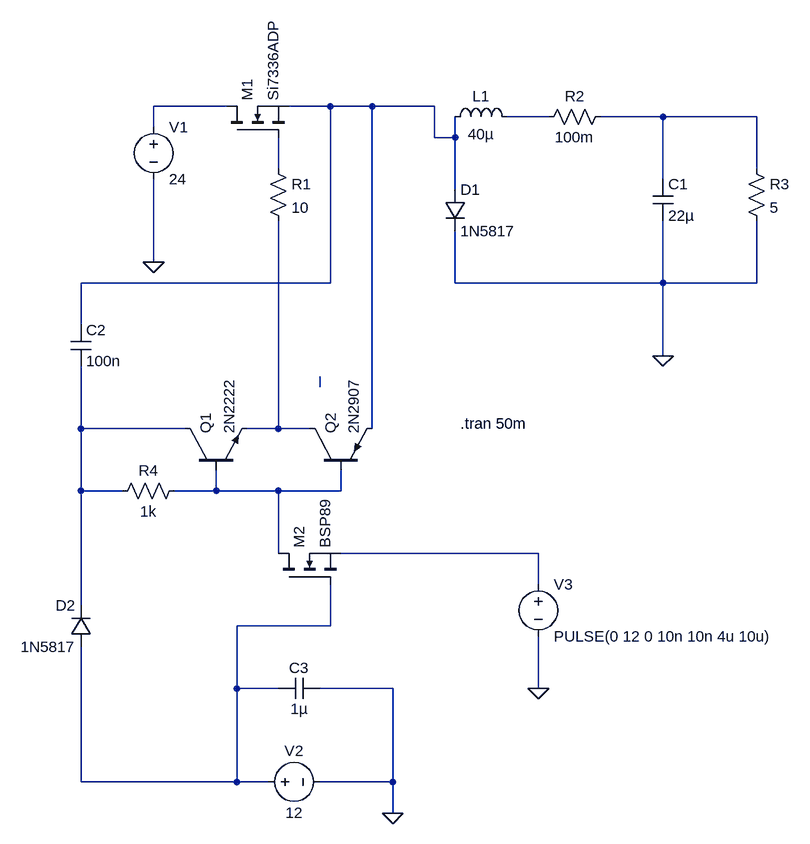
[diagram p0: schematic Draft1.asc]
Draft1.asc, the LTspice schematic file:
Version 4.1
SHEET 1 956 1172
WIRE 80 64 -32 64
WIRE 240 64 176 64
WIRE 304 64 240 64
WIRE 400 64 304 64
WIRE 576 80 512 80
WIRE 752 80 656 80
WIRE 896 80 752 80
WIRE -32 96 -32 64
WIRE 400 112 400 64
WIRE 432 112 432 80
WIRE 432 112 400 112
WIRE 160 160 160 112
WIRE 896 160 896 80
WIRE 752 176 752 80
WIRE 432 192 432 112
WIRE -32 304 -32 176
WIRE 240 336 240 64
WIRE 240 336 -144 336
WIRE 432 336 432 256
WIRE 752 336 752 240
WIRE 752 336 432 336
WIRE 896 336 896 240
WIRE 896 336 752 336
WIRE -144 400 -144 336
WIRE 752 448 752 336
WIRE 224 496 224 480
WIRE -144 560 -144 464
WIRE 16 560 -144 560
WIRE 160 560 160 240
WIRE 160 560 112 560
WIRE 208 560 160 560
WIRE 304 560 304 64
WIRE -144 656 -144 560
WIRE -80 656 -144 656
WIRE 64 656 64 624
WIRE 64 656 0 656
WIRE 160 656 64 656
WIRE 256 656 256 624
WIRE 256 656 160 656
WIRE 160 752 160 656
WIRE 560 752 256 752
WIRE 560 800 560 752
WIRE -144 832 -144 656
WIRE 240 864 240 800
WIRE 240 864 96 864
WIRE 96 960 96 864
WIRE 160 960 96 960
WIRE 336 960 224 960
WIRE 560 960 560 880
WIRE -144 1104 -144 896
WIRE 96 1104 96 960
WIRE 96 1104 -144 1104
WIRE 144 1104 96 1104
WIRE 336 1104 336 960
WIRE 336 1104 224 1104
WIRE 336 1152 336 1104
FLAG 752 448 0
FLAG -32 304 0
FLAG 336 1152 0
FLAG 560 960 0
SYMBOL voltage -32 80 R0
WINDOW 123 0 0 Left 0
WINDOW 39 0 0 Left 0
SYMATTR InstName V1
SYMATTR Value 24
SYMBOL ind 416 96 R270
WINDOW 0 32 56 VTop 2
WINDOW 3 5 56 VBottom 2
SYMATTR InstName L1
SYMATTR Value 40µ
SYMATTR SpiceLine Rser=1m
SYMBOL res 672 64 R90
WINDOW 0 0 56 VBottom 2
WINDOW 3 32 56 VTop 2
SYMATTR InstName R2
SYMATTR Value 100m
SYMBOL cap 736 176 R0
SYMATTR InstName C1
SYMATTR Value 22µ
SYMBOL res 880 144 R0
SYMATTR InstName R3
SYMATTR Value 5
SYMBOL diode 416 192 R0
SYMATTR InstName D1
SYMATTR Value 1N5817
SYMBOL nmos 80 112 R270
SYMATTR InstName M1
SYMATTR Value Si7336ADP
SYMBOL res 144 144 R0
SYMATTR InstName R1
SYMATTR Value 10
SYMBOL npn 16 624 R270
SYMATTR InstName Q1
SYMATTR Value 2N2222
SYMBOL pnp 208 624 R270
SYMATTR InstName Q2
SYMATTR Value 2N2907
SYMBOL cap -160 400 R0
SYMATTR InstName C2
SYMATTR Value 100n
SYMBOL voltage 128 1104 R270
WINDOW 0 32 56 VTop 2
WINDOW 3 -32 56 VBottom 2
WINDOW 123 0 0 Left 0
WINDOW 39 0 0 Left 0
SYMATTR InstName V2
SYMATTR Value 12
SYMBOL diode -128 896 R180
WINDOW 0 24 64 Left 2
WINDOW 3 24 0 Left 2
SYMATTR InstName D2
SYMATTR Value 1N5817
SYMATTR Description Diode
SYMATTR Type diode
SYMBOL cap 160 976 R270
WINDOW 0 32 32 VTop 2
WINDOW 3 0 32 VBottom 2
SYMATTR InstName C3
SYMATTR Value 1µ
SYMBOL nmos 160 800 R270
SYMATTR InstName M2
SYMATTR Value BSP89
SYMBOL voltage 560 784 R0
WINDOW 123 0 0 Left 0
WINDOW 39 0 0 Left 0
SYMATTR InstName V3
SYMATTR Value PULSE(0 12 0 10n 10n 4u 10u)
SYMBOL res 16 640 R90
WINDOW 0 0 56 VBottom 2
WINDOW 3 32 56 VTop 2
SYMATTR InstName R4
SYMATTR Value 1k
TEXT 440 552 Left 2 !.tran 50m

The netlist it stands for:
* Draft1.asc
V1 N001 0 24
L1 N002 N003 40µ Rser=1m
R2 N004 N003 100m
C1 N004 0 22µ
R3 N004 0 5
D1 N002 0 1N5817
M1 N001 N005 N002 N002 Si7336ADP
R1 N005 N008 10
Q1 N007 N009 N008 0 2N2222
Q2 N008 N009 N002 0 2N2907
C2 N002 N007 100n
V2 N011 0 12
D2 N011 N007 1N5817
C3 N011 0 1µ
M2 N009 N011 N010 N010 BSP89
V3 N010 0 PULSE(0 12 0 10n 10n 4u 10u)
R4 N009 N007 1k
.model D D
.lib standard.dio
.model NPN NPN
.model PNP PNP
.lib standard.bjt
.model NMOS NMOS
.model PMOS PMOS
.lib standard.mos
.tran 50m
.backanno
.end